# Altium schematic sheet CH32F&V208C-R0.SchDoc
size 406 x 254 mm
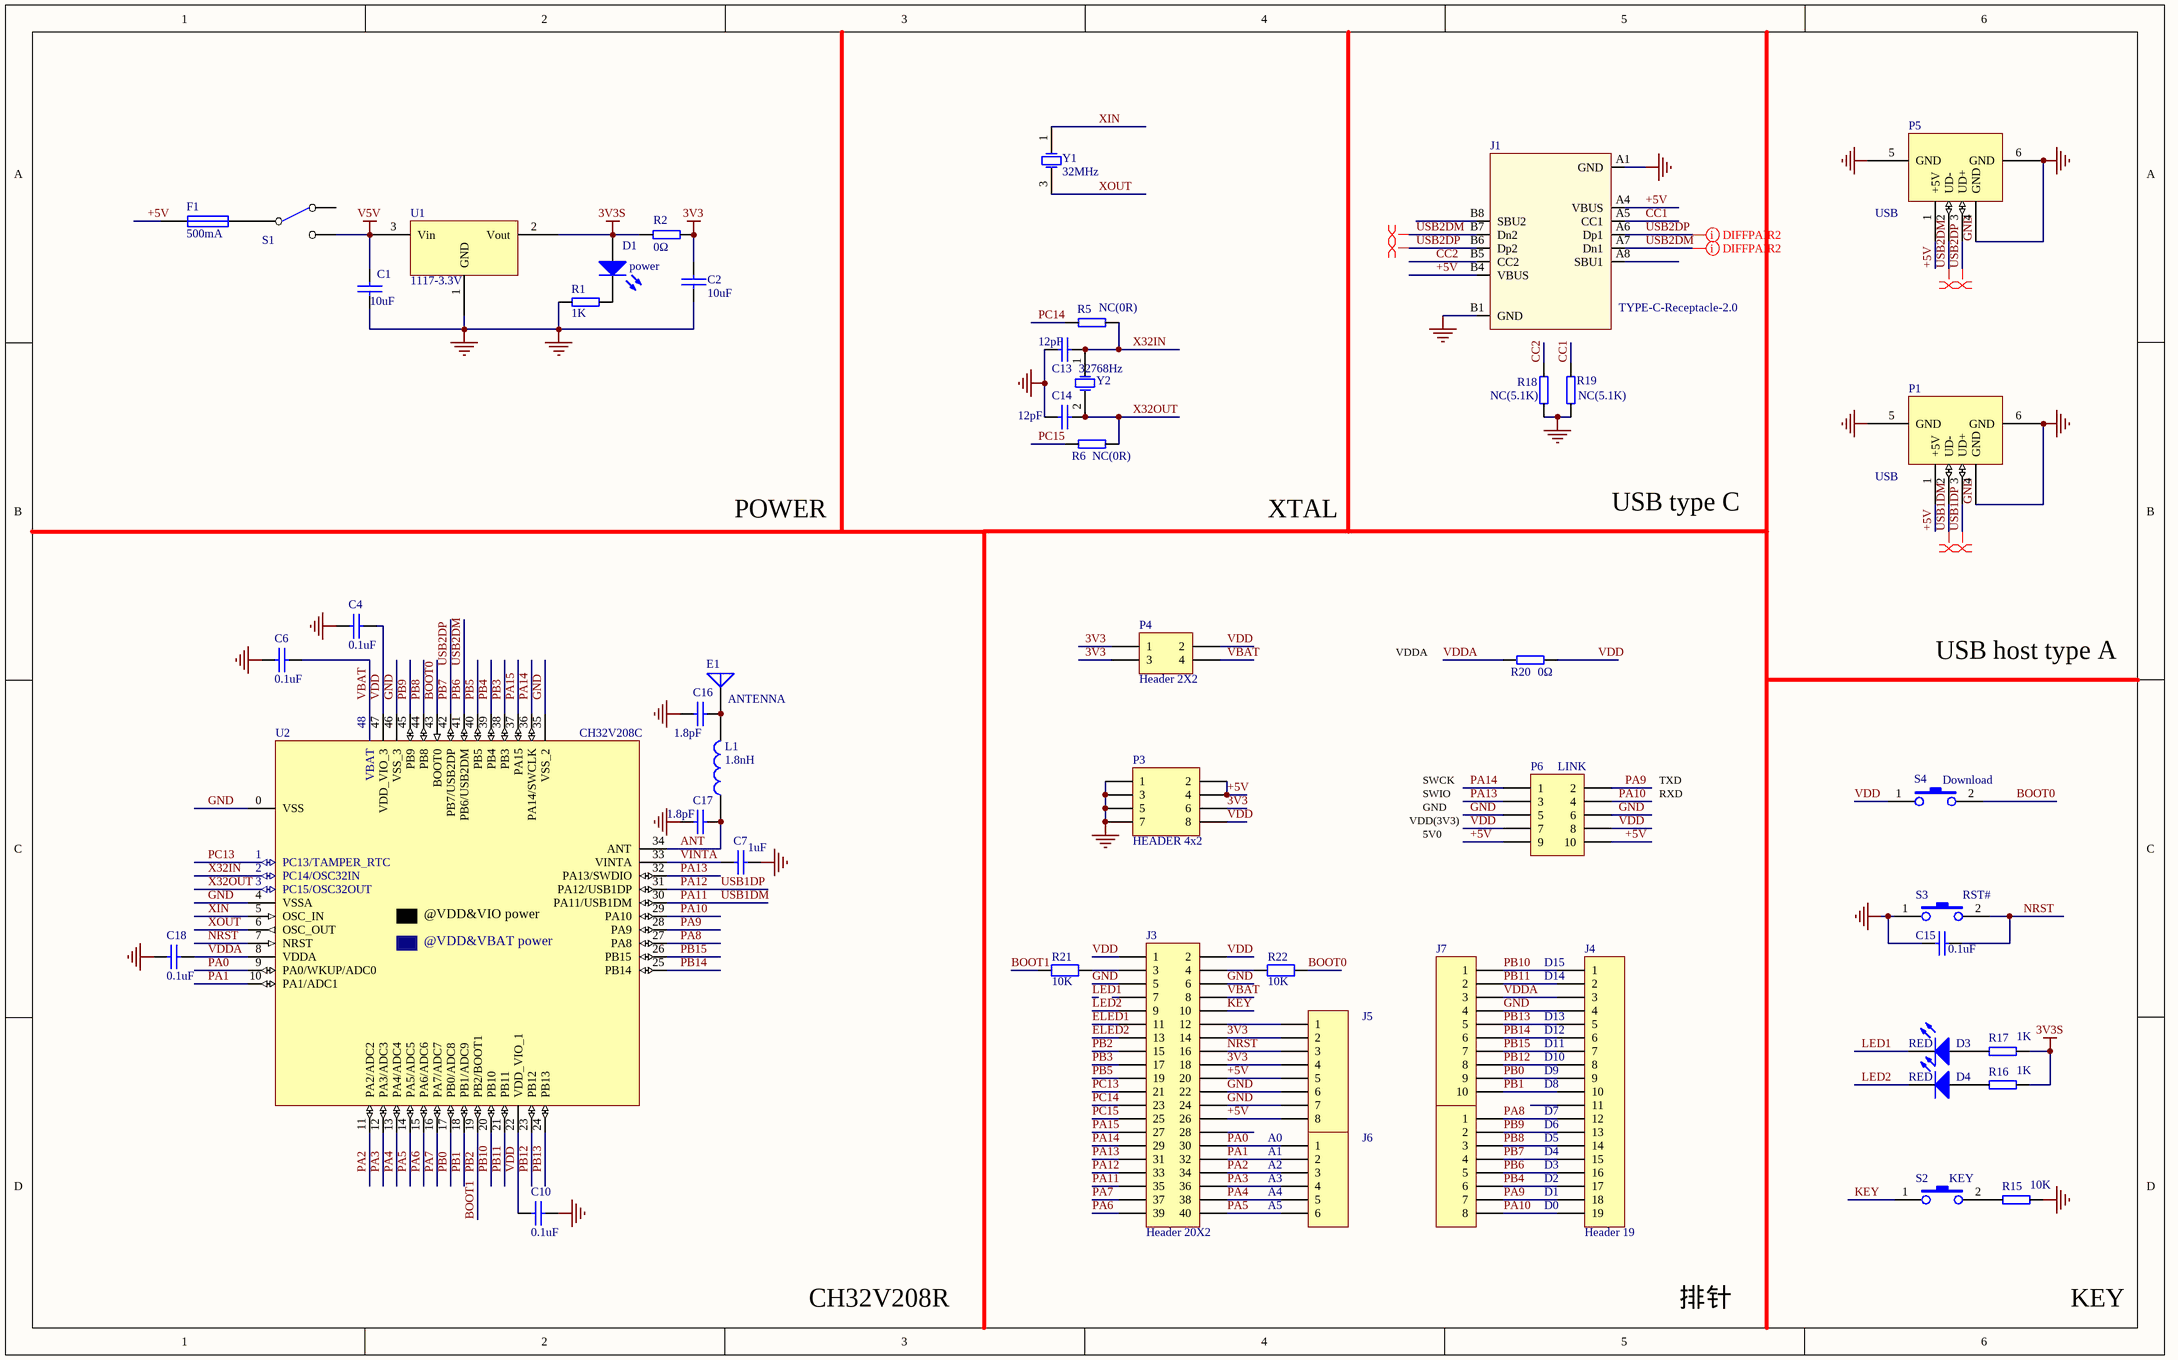
[diagram p0: CH32F&V208C-R0.SchDoc]

## Parts
C1  10uF  [3216_C]
C2  10uF  [0603_C]
C4  0.1uF  [0603_C]
C6  0.1uF  [0603_C]
C7  1uF  [0603_C]
C10  0.1uF  [0603_C]
C13  12pF  [0603_C]
C14  12pF  [0603_C]
C15  0.1uF  [0603_C]
C16  1.8pF  [0603_C]
C17  1.8pF  [0603_C]
C18  0.1uF  [0603_C]
D1  power  [0603+]
D3  RED  [0603+]
D4  RED  [0603+]
E1  ANTENNA  [ANT-F-1-2.4G-1.6mmFR4]
F1  500mA  [0603]
J1  TYPE-C-Receptacle-2.0  [TYPE-C-Receptacle-2.0]
J3  Header 20X2  [IDC40-2.54mm]
J4  Header 19  [SIP19-2.54mm]
J5  Header 8  [SIP8-2.54mm]  (value not drawn)
J6  Header 6  [SIP6-2.54MM]  (value not drawn)
J7  Header 10  [SIP10-2.54mm]  (value not drawn)
J8  Header 8  [SIP8-2.54mm]  (value not drawn)
L1  1.8nH  [0603]
P1  USB  [USBAF]
P3  HEADER 4x2  [IDC8-2.54mm]
P4  Header 2X2  [IDC4-2.54mm]
P5  USB  [USBAF]
P6  LINK  [IDC10-2.54mm]
R1  1K  [0603]
R2  0Ω  [0603]
R5  NC(0R)  [0603]
R6  NC(0R)  [0603]
R15  10K  [0603]
R16  1K  [0603]
R17  1K  [0603]
R18  NC(5.1K)  [0603]
R19  NC(5.1K)  [0603]
R20  0Ω  [0603]
R21  10K  [0603]
R22  10K  [0603]
S1  SW SPDT  [SW1]  (value not drawn)
S2  KEY  [SMD_6.1x3.65x2.5mm-KEY]
S3  RST#  [SMD_6.1x3.65x2.5mm-KEY]
S4  Download  [SMD_6.1x3.65x2.5mm-KEY]
U1  1117-3.3V  [SOT-223]
U2  CH32V208C  [QFN48_5x5]
Y1  32MHz  [XT3225]
Y2  32768Hz  [FC-135]

## Nets
3V3: C2.1 J3.14 J3.18 J5.2 J5.4 P3.6 P4.1 P4.3 R2.1
3V3S: D1.1(A) R2.2 R16.1 R17.1 U1.2(Vout)
GND: C1.2 C2.2 C4.2 C6.2 C7.2 C10.1 C13.1 C14.1 C15.1 C16.1 C17.1 C18.2 J1.A1(GND) J1.B1(GND) J3.5 J3.6 J3.22 J3.24 J4.4 J5.6 J5.7 J7.4 P1.4(GND) P1.5(GND) P1.6(GND) P3.1 P3.3 P3.5 P3.7 P5.4(GND) P5.5(GND) P5.6(GND) P6.5 P6.6 R1.1 R15.1 R18.2 R19.2 S3.1 U1.1(GND) U2.0(VSS) U2.4(VSSA) U2.35(VSS_2) U2.46(VSS_3)
V5V: C1.1 S1.2(NC) U1.3(Vin)
+5V: F1.1 J1.A4(VBUS) J1.B4(VBUS) J3.20 J3.26 J5.5 J5.8 P1.1(+5V) P3.2 P3.4 P5.1(+5V) P6.9 P6.10
ANT: C17.2 L1.1 U2.34(ANT)
BOOT0: R22.2 S4.2 U2.43(BOOT0)
BOOT1: J3.15 R21.1 U2.19(PB2/BOOT1)  [also labelled PB2]
CC1: J1.A5(CC1) R19.1
CC2: J1.B5(CC2) R18.1
ELED1: J3.11
ELED2: J3.13
KEY: J3.10 S2.1
LED1: D3.2(K)
LED2: D4.2(K) J3.9
NRST: C15.2 J3.16 J5.3 S3.2 U2.7(NRST)
PA0: J3.30 J6.1 U2.9(PA0/WKUP/ADC0)
PA1: J3.32 J6.2 U2.10(PA1/ADC1)
PA2: J3.34 J6.3 U2.11(PA2/ADC2)
PA3: J3.36 J6.4 U2.12(PA3/ADC3)
PA4: J3.38 J6.5 U2.13(PA4/ADC4)
PA5: J3.40 J6.6 U2.14(PA5/ADC5)
PA6: J3.39 U2.15(PA6/ADC6)
PA7: J3.37 U2.16(PA7/ADC7)
PA8: J4.12 J8.1 U2.27(PA8)
PA9: J4.18 J8.7 P6.2 U2.28(PA9)
PA10: J4.19 J8.8 P6.4 U2.29(PA10)
PA11: J3.35 P1.2(UD-) U2.30(PA11/USB1DM)  [also labelled USB1DM]
PA12: J3.33 P1.3(UD+) U2.31(PA12/USB1DP)  [also labelled USB1DP]
PA13: J3.31 P6.3 U2.32(PA13/SWDIO)
PA14: J3.29 P6.1 U2.36(PA14/SWCLK)
PA15: J3.27 U2.37(PA15)
PB0: J4.9 J7.9 U2.17(PB0/ADC8)
PB1: J4.10 J7.10 U2.18(PB1/ADC9)
PB3: J3.17 U2.38(PB3)
PB4: J4.17 J8.6 U2.39(PB4)
PB5: J3.19 U2.40(PB5)
PB6: J1.A7(Dn1) J1.B7(Dn2) J4.16 J8.5 P5.2(UD-) U2.41(PB6/USB2DM)  [also labelled USB2DM]
PB7: J1.A6(Dp1) J1.B6(Dp2) J4.15 J8.4 P5.3(UD+) U2.42(PB7/USB2DP)  [also labelled USB2DP]
PB8: J4.14 J8.3 U2.44(PB8)
PB9: J4.13 J8.2 U2.45(PB9)
PB10: J4.1 J7.1 U2.20(PB10)
PB11: J4.2 J7.2 U2.21(PB11)
PB12: J4.8 J7.8 U2.23(PB12)
PB13: J4.5 J7.5 U2.24(PB13)
PB14: J4.6 J7.6 U2.25(PB14)
PB15: J4.7 J7.7 U2.26(PB15)
PC13: J3.21 U2.1(PC13/TAMPER_RTC)
PC14: J3.23 R5.1
PC15: J3.25 R6.1
VBAT: C6.1 J3.8 P4.4 U2.48(VBAT)
VDD: C4.1 C10.2 J3.1 J3.2 P3.8 P4.2 P6.7 P6.8 R20.1 S4.1 U2.22(VDD_VIO_1) U2.47(VDD_VIO_3)
VDDA: C18.1 J4.3 J7.3 R20.2 U2.8(VDDA)
VINTA: C7.1 U2.33(VINTA)
X32IN: C13.2 R5.2 U2.2(PC14/OSC32IN) Y2.1(OSC1)
X32OUT: C14.2 R6.2 U2.3(PC15/OSC32OUT) Y2.2(OSC2)
XIN: U2.5(OSC_IN) Y1.1(OSC1)
XOUT: U2.6(OSC_OUT) Y1.3(OSC2)
NetC16_2: C16.2 E1.1(A) L1.2
NetD1_2: D1.2(K) R1.2
NetD3_1: D3.1(A) R17.2
NetD4_1: D4.1(A) R16.2
NetF1_2: F1.2 S1.1(COMMON)
NetJ3_3: J3.3 R21.2
NetJ3_4: J3.4 R22.1
NetJ3_12: J3.12 J5.1
NetR15_2: R15.2 S2.2

Not connected (* = marked no-connect by the designer): J1 A8(SBU1) B8(SBU2); J3 7 28; J4 11; S1 3(NO)

## Layout directives
differential pair: PA11, PA12, PB6, PB7

## Notes on the sheet
- POWER
- XTAL
- USB type C
- VDDA
- USB host type A
- VDD(3V3)
- SWCK
- SWIO
- 5V0
- GND
- TXD
- RXD
- (near J4) D14
- (near J4) D15
- (near J4) D12
- (near J4) D13
- (near J4) D7
- (near J4) D8
- (near J4) D9
- (near J4) D10
- (near J4) D11
- A0
- A1
- (near J6) A2
- (near J4) D3
- (near J4) D4
- (near J4) D5
- (near J4) D6
- (near J6) A3
- (near J6) A4
- (near J6) A5
- (near J4) D0
- (near J4) D1
- (near J4) D2
- CH32V208R
- 排针
- KEY
- (in symbol CH32V208C) @VDD&VIO power; @VDD&VBAT power

## Library data of the parts
C1 C2 C4 C6 C7 C10 C13-C18 = CAP: Capacitor
D1 D3 D4 = LED0: Typical INFRARED GaAs LED; Published: 8-Jun-2000; LatestRevisionDate: 08-Jul-2005; LatestRevisionNote: Mech Layer 1 removed.; PackageReference: LED-0; Publisher: Altium Limited; PackageDescription: LED; 2 Leads
E1 = ANTENNA: Generic Antenna
F1 = FUSE1: Fuse
J1 = TYPE-C-Receptacle-2.0: Type-C USB2.0 母座
J3 = Header 20X2: Header, 20-Pin, Dual row; LatestRevisionDate: 17-Jul-2002; LatestRevisionNote: Re-released for DXP Platform.; Publisher: Altium Limited
J4 = Header 19: Header, 19-Pin; LatestRevisionDate: 17-Jul-2002; LatestRevisionNote: Re-released for DXP Platform.; Publisher: Altium Limited
J5 J8 = Header 8: Header, 8-Pin; LatestRevisionDate: 17-Jul-2002; LatestRevisionNote: Re-released for DXP Platform.; Publisher: Altium Limited
J6 = Header 6: Header, 6-Pin; LatestRevisionDate: 17-Jul-2002; LatestRevisionNote: Re-released for DXP Platform.; Publisher: Altium Limited
J7 = Header 10: Header, 10-Pin; LatestRevisionDate: 17-Jul-2002; LatestRevisionNote: Re-released for DXP Platform.; Publisher: Altium Limited
L1 = INDUCTOR
P1 P5 = USB: USB Port
P3 = HEADER 4x2: Header, 4-Pin, Dual row
P4 = Header 2X2: Header, 2-Pin, Dual row; LatestRevisionDate: 17-Jul-2002; LatestRevisionNote: Re-released for DXP Platform.; Publisher: Altium Limited
P6 = Header 5X2H: Header, 5-Pin, Dual row, Right Angle; LatestRevisionDate: 17-Jul-2002; LatestRevisionNote: Re-released for DXP Platform.; Publisher: Altium Limited
R1 R2 R5 R6 R15-R19 = RES
R20 = R
R21 R22 = Res2: Resistor
S2-S4 = KEY1
U2 = CH32V208C: RISC-V BLE5.3 MCU, 10M Ethernet, 2*USB, CAN
Y1 Y2 = XTAL: Crystal Oscillator; Published: 8-Jun-2000; LatestRevisionDate: 17-Jul-2002; LatestRevisionNote: Re-released for DXP Platform.; PackageReference: R38; Publisher: Altium Limited; PackageDescription: Crystal, Thru-Hole; 2 Leads; Body 3.1 x 8.2 mm (Dia.xH)